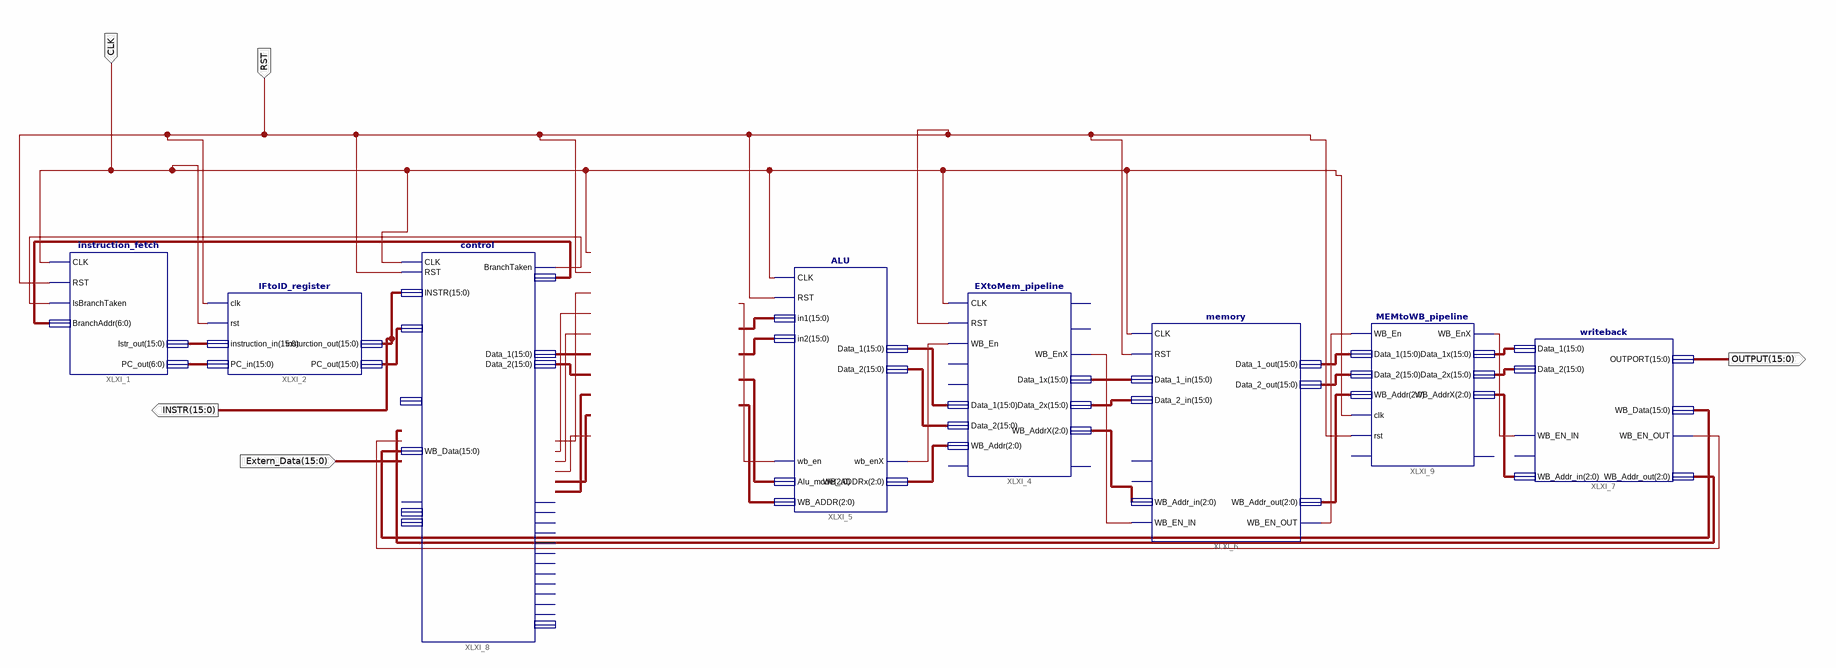
[diagram p0: schematic sheet 1]
// Xilinx ISE schematic cpu.sch (spartan3e) as structural Verilog: 8 symbols, 5 ports
module cpu (
  input  [15:0] Extern_Data,
  input  CLK,
  input  RST,
  output [15:0] INSTR,
  output [15:0] OUTPUT
);

  wire XLXN_27, XLXN_28, XLXN_42, XLXN_43, XLXN_44, XLXN_45, XLXN_58;
  wire [2:0] XLXN_25, XLXN_26, XLXN_29, XLXN_34, XLXN_37, XLXN_41, XLXN_46;
  wire [6:0] XLXN_2, XLXN_59;
  wire [15:0] XLXN_1, XLXN_11, XLXN_18, XLXN_19, XLXN_23, XLXN_24, XLXN_30, XLXN_31, XLXN_32, XLXN_33,
       XLXN_35, XLXN_36, XLXN_38, XLXN_39, XLXN_47;

  EXtoMem_pipeline XLXI_4 (
    .CLK(CLK), .RST(RST), .WB_En(XLXN_28), .Data_1(XLXN_31), .Data_2(XLXN_30), .WB_Addr(XLXN_29),
    .WB_EnX(XLXN_43), .Data_1x(XLXN_32), .Data_2x(XLXN_33), .WB_AddrX(XLXN_34));  // open: Mem_wr_en, Mem_rd_en, Mem_wr_enX, Mem_rd_enX, Outport_En, Outport_EnX
  ALU XLXI_5 (
    .CLK(CLK), .RST(RST), .in1(XLXN_23), .in2(XLXN_24), .Data_1(XLXN_31), .Data_2(XLXN_30), .wb_en(XLXN_27),
    .Alu_mode(XLXN_25), .WB_ADDR(XLXN_26), .wb_enX(XLXN_28), .WB_ADDRx(XLXN_29));
  memory XLXI_6 (
    .CLK(CLK), .RST(RST), .Data_1_in(XLXN_32), .Data_2_in(XLXN_33), .WB_Addr_in(XLXN_34),
    .Data_1_out(XLXN_35), .Data_2_out(XLXN_36), .WB_Addr_out(XLXN_37), .WB_EN_IN(XLXN_43), .WB_EN_OUT(XLXN_44));  // open: Mem_wr_en, Mem_rd_en
  writeback XLXI_7 (
    .WB_EN_IN(XLXN_42), .Data_1(XLXN_38), .Data_2(XLXN_39), .WB_EN_OUT(XLXN_45), .OUTPORT(OUTPUT),
    .WB_Data(XLXN_47), .WB_Addr_in(XLXN_41), .WB_Addr_out(XLXN_46));  // open: Out_Port_En
  control XLXI_8 (
    .CLK(CLK), .RST(RST), .INSTR(INSTR), .WB_Data(XLXN_47), .BranchTaken(XLXN_58), .Data_1(XLXN_18),
    .Data_2(XLXN_19));  // open: CurrentPC, BranchPC, wb_en, WB_Addr, In_Data, add_en, sub_en, mul_en, nand_en, shl_en, shr_en, load_en, loadimm_en, mov_en, in_en, out_en, store_en, WB_AddrX
  MEMtoWB_pipeline XLXI_9 (
    .clk(CLK), .rst(RST), .WB_En(XLXN_44), .Data_1(XLXN_35), .Data_2(XLXN_36), .WB_Addr(XLXN_37),
    .WB_EnX(XLXN_42), .Data_1x(XLXN_38), .Data_2x(XLXN_39), .WB_AddrX(XLXN_41));  // open: Outport_En, Outport_Enx
  instruction_fetch XLXI_1 (
    .CLK(CLK), .RST(RST), .IsBranchTaken(XLXN_58), .BranchAddr(XLXN_59), .Istr_out(XLXN_1), .PC_out(XLXN_2));
  IFtoID_register XLXI_2 (
    .clk(RST), .rst(CLK), .instruction_in(XLXN_1), .insturction_out(INSTR), .PC_in(XLXN_2), .PC_out(XLXN_11));
endmodule
